# EAGLE design riffle-1.01-FTDI-A (EAGLE 7.2.0)
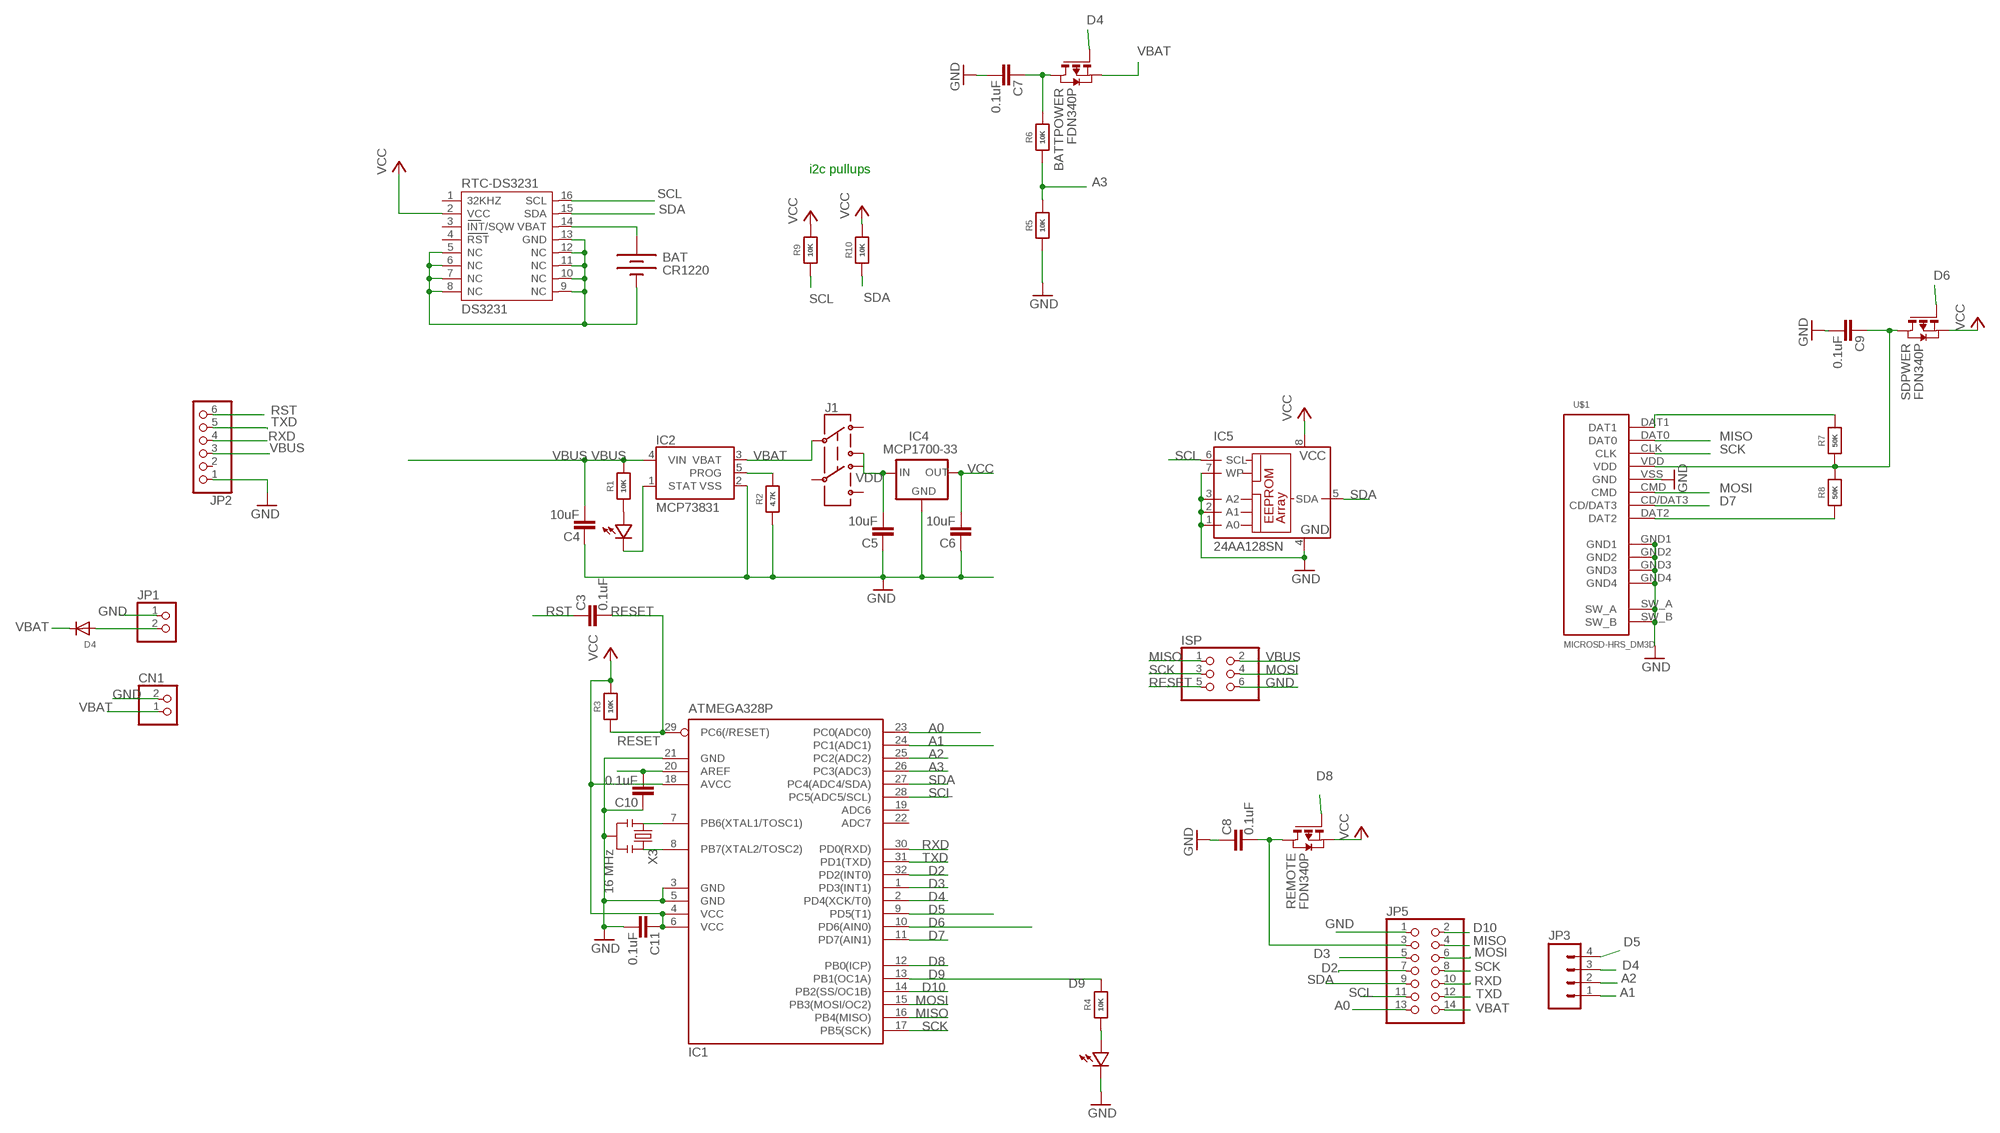
[diagram p0: schematic, sheet 1]

## Parts
BAT  CR1220  BATTERYBATTERY_12MM_SMT  [BATTCON_12MM_SMT]
BATTPOWER  FDN340P  PMOSSOT23  [SOT-23]
C3  0.1uF  CAP0603-CAP  [0603-CAP]
C4  10uF  CAP0603-CAP  [0603-CAP]
C5  10uF  CAP0603-CAP  [0603-CAP]
C6  10uF  CAP0603-CAP  [0603-CAP]
C7  0.1uF  CAP0603-CAP  [0603-CAP]
C8  0.1uF  CAP0603-CAP  [0603-CAP]
C9  0.1uF  CAP0603-CAP  [0603-CAP]
C10  0.1uF  CAP0603-CAP  [0603-CAP]
C11  0.1uF  CAP0603-CAP  [0603-CAP]
CN1  JST_2PIN-SMT-RA  [JST-PH-2-SMT-RA]
D1  LED0603  [0603-LED]
D2  LED0603  [0603-LED]
D4  DIODESOD-323F  [SOD-323F]
IC1  ATMEGA328P  MEGA8-AI  [TQFP32-08]
IC2  MCP73831  [SOT23-5]
IC4  MCP1700-33  MCP1700SOT89  [SOT89]
IC5  24AA128SN  [SO-08]
ISP  PINHD-2X3  [2X03]
J1  AYZ0202  [AYZ0202]
JP1  PINHD-1X2  [1X02]
JP2  PINHD-1X6  [1X06]
JP3  M04SMD  [1X04-SMD]
JP5  PINHD-2X7  [2X07]
R1  10K  RESISTOR_0603_NOOUT  [0603-NO]
R2  4.7K  RESISTOR_0603_NOOUT  [0603-NO]
R3  10K  RESISTOR_0603_NOOUT  [0603-NO]
R4  10K  RESISTOR_0603_NOOUT  [0603-NO]
R5  10K  RESISTOR_0603_NOOUT  [0603-NO]
R6  10K  RESISTOR_0603_NOOUT  [0603-NO]
R7  50K  RESISTOR_0603_NOOUT  [0603-NO]
R8  50K  RESISTOR_0603_NOOUT  [0603-NO]
R9  10K  RESISTOR_0603_NOOUT  [0603-NO]
R10  10K  RESISTOR_0603_NOOUT  [0603-NO]
REMOTE  FDN340P  PMOSSOT23  [SOT-23]
RTC-DS3231  DS3231  [DS3231]
SDPWER  FDN340P  PMOSSOT23  [SOT-23]
U$1  MICROSD-HRS_DM3D  [DM3D]
X3  16 MHz  RESONATORSMD  [RESONATOR-SMD]

## Nets
A0: IC1.23(PC0(ADC0)) JP5.13
A1: IC1.24(PC1(ADC1)) JP3.1
A2: IC1.25(PC2(ADC2)) JP3.2
A3: IC1.26(PC3(ADC3)) R5.2 R6.1
AREF: C10.1 IC1.20(AREF)
D2: IC1.32(PD2(INT0)) JP5.7
D3: IC1.1(PD3(INT1)) JP5.5
D4: BATTPOWER.3(G) IC1.2(PD4(XCK/T0)) JP3.3
D5: IC1.9(PD5(T1)) JP3.4
D6: IC1.10(PD6(AIN0)) SDPWER.3(G)
D7: IC1.11(PD7(AIN1)) U$1.CD/DAT3
D8: IC1.12(PB0(ICP)) REMOTE.3(G)
D9: IC1.13(PB1(OC1A)) R4.2
D10: IC1.14(PB2(SS/OC1B)) JP5.2
GND: BAT.P$1(-) C4.2 C5.2 C6.2 C7.1 C8.2 C9.1 C10.2 C11.1 CN1.2 D2.MINUS IC1.3(GND) IC1.5(GND) IC1.21(GND) IC2.2(VSS) IC4.1(GND) IC5.1(A0) IC5.2(A1) IC5.3(A2) IC5.4(GND) IC5.7(WP) ISP.6 JP1.1 JP2.1 JP5.1 R2.1 R5.1 RTC-DS3231.5(NC) RTC-DS3231.6(NC) RTC-DS3231.7(NC) RTC-DS3231.8(NC) RTC-DS3231.9(NC) RTC-DS3231.10(NC) RTC-DS3231.11(NC) RTC-DS3231.12(NC) RTC-DS3231.13(GND) U$1.GND1 U$1.GND2 U$1.GND3 U$1.GND4 U$1.SW_A U$1.SW_B U$1.VSS(GND) X3.2
MISO: IC1.16(PB4(MISO)) ISP.1 JP5.4 U$1.DAT0
MOSI: IC1.15(PB3(MOSI/OC2)) ISP.4 JP5.6 U$1.CMD
N$1: D1.PLUS R1.1
N$2: IC1.7(PB6(XTAL1/TOSC1)) X3.1
N$3: IC1.8(PB7(XTAL2/TOSC2)) X3.3
N$4: C9.2 R7.1 R8.2 SDPWER.1(D) U$1.VDD
N$5: D1.MINUS IC2.1(STAT)
N$6: IC2.5(PROG) R2.2
N$7: C8.1 JP5.3 REMOTE.1(D)
N$14: D4.A JP1.2
N$15: BATTPOWER.1(D) C7.2 R6.2
N$16: R7.2 U$1.DAT1
N$17: D2.PLUS R4.1
N$18: R8.1 U$1.DAT2
RESET: C3.1 IC1.29(PC6(/RESET)) ISP.5 R3.1
RST: C3.2 JP2.6
RTC_BATT: BAT.P$2(+) RTC-DS3231.14(VBAT)
RXD: IC1.30(PD0(RXD)) JP2.4 JP5.10
SCK: IC1.17(PB5(SCK)) ISP.3 JP5.8 U$1.CLK
SCL: IC1.28(PC5(ADC5/SCL)) IC5.6(SCL) JP5.11 R9.1 RTC-DS3231.16(SCL)
SDA: IC1.27(PC4(ADC4/SDA)) IC5.5(SDA) JP5.9 R10.1 RTC-DS3231.15(SDA)
TXD: IC1.31(PD1(TXD)) JP2.5 JP5.12
VBAT [vcc]: BATTPOWER.2(S) CN1.1 D4.C IC2.3(VBAT) J1.2 JP5.14
VBUS [vcc]: C4.1 IC2.4(VIN) ISP.2 JP2.3 R1.2
VCC: C6.1 C11.2 IC1.4(VCC) IC1.6(VCC) IC1.18(AVCC) IC4.3(OUT) IC5.8(VCC) R3.2 R9.2 R10.2 REMOTE.2(S) RTC-DS3231.2(VCC) SDPWER.2(S)
VDD: C5.1 IC4.2(IN) J1.1
Unconnected: IC1.19(ADC6) IC1.22(ADC7) J1.3 J1.4 J1.5 J1.6 JP2.2 RTC-DS3231.1(32KHZ) RTC-DS3231.3(INT/SQW) RTC-DS3231.4(RST)

## Notes on the sheet
- i2c pullups

## Library data of the parts
BAT = SparkFunNew:BATTERY: Battery Holders Various common sizes : AA, AAA, 20mm coin cell and 12mm coin cell.
BATTPOWER REMOTE SDPWER = zetex:PMOSSOT23: MOS FET; OC_FARNELL: unknown; OC_NEWARK: unknown
C3-C11 = SparkFun:CAP: Capacitor Standard 0603 ceramic capacitor, and 0.1" leaded capacitor.
CN1 = adafruit:JST_2PIN: JST 2-Pin Connectors of various flavors SMT-RA (S2B-PH-SM4) 4UConnector #17311 SMT (B2B-PH-SM4) THM-RA (S2B-PH) THM (B2B-PH)
D1 D2 = LowPowerLab:LED
D4 = adafruit:DIODE: Diode SMADIODE - SMA Surface Mount Package 20V 1A Schottky Diode Digikey: 641-1014-6-ND DO-1N4148 - Through Hole Small Current Diode SOD-123 20V 1 A (.5mV Vf) Schottky Diode - Digikey: MBRX120TPMSCT-ND SOD-323 10V 570mA (.38mV Vf, 3ns) Schottky Diode - Digikey: ZLLS410CT-ND SOD-523 30V 30mA Schottky Diode (RB751S-40TE61) - Digikey: RB751S-40TE61CT-ND SOT23-R/W - SOT23 Package (R = Solder Paste/Reflow Ovens, W = Hand-Soldering) BAT54Film 40V 300mA - Digikey: 497-7162-1-ND
IC1 = atmel:MEGA8: MICROCONTROLLER 8 Kbytes FLASH, 1 kbytes SRAM, 512 bytes EEPROM, USART, 6-channel 10 bit ADC, 2-channel 8 bit ADC Pin compatible with Atmega48, ATMega88, ATMega168 Source: avr.lbr; MPN: ATMEGA8-16AU; OC_FARNELL: 9171371; OC_NEWARK: 73M8863
IC2 = SparkFunNew:MCP73831: Microchip's MCP73831 Miniature single cell, fully integrated Li-Ion, Li-polymer charge management controller http://ww1.microchip.com/downloads/en/DeviceDoc/21984a.pdf
IC4 = adafruit:MCP1700: VOLTAGE REGULATOR
IC5 = microchip:24*: Serial EEPROM I2C; MF: MICROCHIP; MPN: 24AA128-I/SN; OC_FARNELL: unknown; OC_NEWARK: 92C6842
ISP = pinhead:PINHD-2X3: PIN HEADER
J1 = SparkFunNew:AYZ0202: SPDT Slide Switch Simple SMD single-pull double-throw slide switch. Good for less than 350mA power switch, switching UARTs between devices, etc. Spark Fun Electronics SKU : COM-00597
JP1 = pinhead:PINHD-1X2: PIN HEADER
JP2 = pinhead:PINHD-1X6: PIN HEADER
JP3 = SparkFun:M04: Header 4 Standard 4-pin 0.1" header. Use with straight break away headers (SKU : PRT-00116), right angle break away headers (PRT-00553), swiss pins (PRT-00743), machine pins (PRT-00117), and female headers (PRT-00115). Molex polarized connector foot print use with SKU : PRT-08231 with associated crimp pins and housings.
JP5 = pinhead:PINHD-2X7: PIN HEADER
R1-R10 = microbuilder:RESISTOR: Resistors For new designs, use the packages preceded by an '_' character since they are more reliable: The following footprints should be used on most boards: _0402 - Standard footprint for regular board layouts _0603 - Standard footprint for regular board layouts _0805 - Standard footprint for regular board layouts _1206 - Standard footprint for regular board layouts For extremely tight-pitch boards where space is at a premium, the following 'micro-pitch' footprints can be used (smaller pads, no silkscreen outline, etc.): _0402MP - Micro-pitch footprint for very dense/compact boards _0603MP - Micro-pitch footprint for very dense/compact boards _0805MP - Micro-pitch footprint for very dense/compact boards _1206MP - Micro-pitch footprint for very dense/compact boards
RTC-DS3231 = _lh-library:DS3231
U$1 = hrs_DM3D-SF:MICROSD-HRS_DM3D
X3 = SparkFun:RESONATOR: Resonator Small SMD resonator. This is the itty bitty 10/20MHz resonators with built in caps. CSTCE10M0G55 and CSTCE20M0V53. Footprint has been reviewed closely but hasn't been tested yet.

## Board
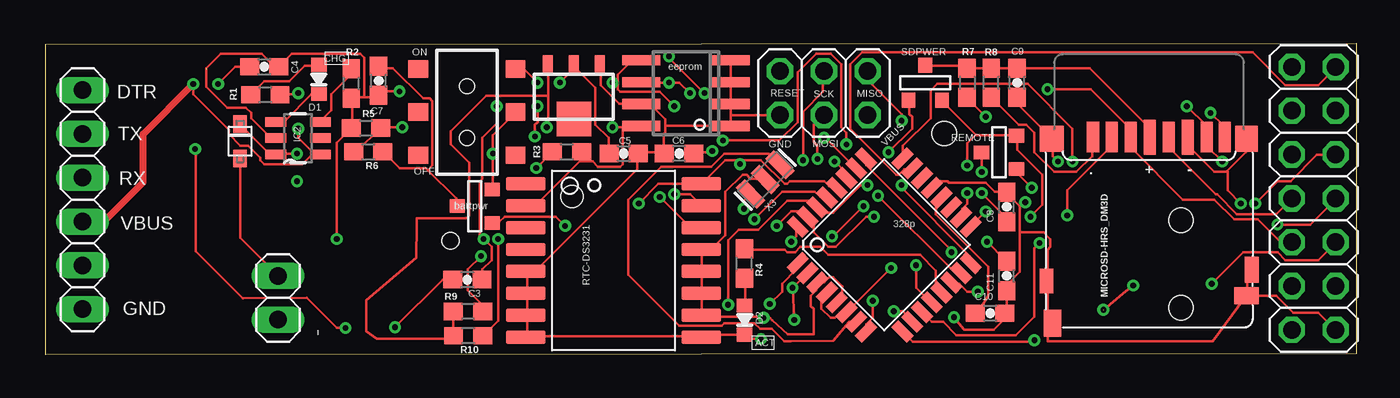
[diagram p1: board, top side]
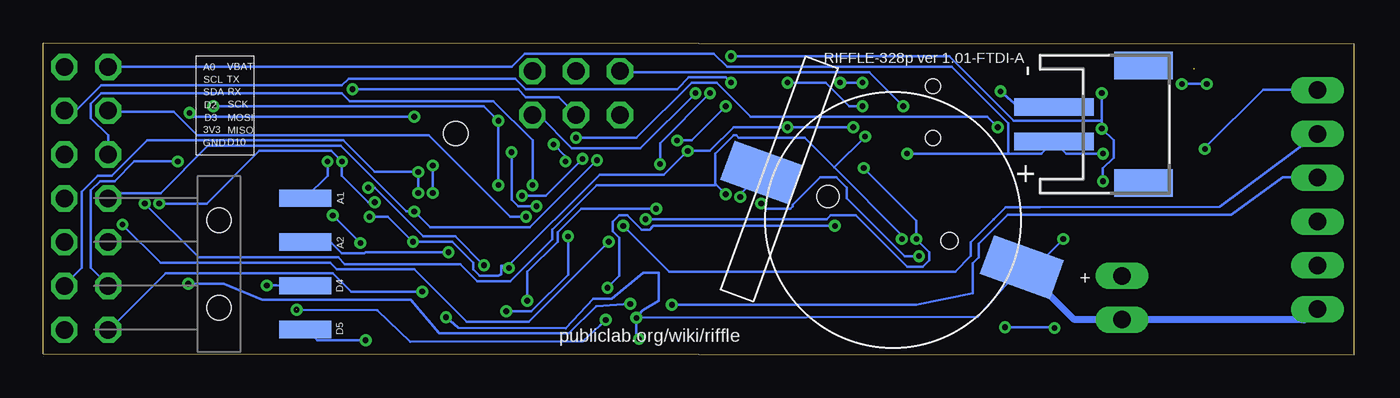
[diagram p2: board, bottom side, seen from below]

Size 76 x 18.06 mm. Coordinates in mm from the lower left corner, seen from the top.
Outline: 0,0 0,18 76,18.06 76,0.06 0,0
Copper layers (1*16): Top 0.0356mm / dielectric 1.5011mm / Bottom 0.0356mm
Design rules "LaenPCBOrder": minimum track width 6mil, minimum drill 13mil, track to track 6mil, track to pad 6mil, pad to pad 6mil, via to via 6mil, smd to smd 6mil, copper to edge 15mil, drill to drill 6mil, minimum pad ring 7mil, minimum via ring 7mil, stop-mask expansion 3mil, vias tented up to drill 0mil, thermal gap 10mil
Holes 1.4 mm at 52.08,12.83

### Footprints (pad centres in the part's own frame; a part is rotated, then mirrored left to right if it is on the bottom)
BATTCON_12MM_SMT = smd 2.4 x 4.3: P$1 0,11.96 | smd 2.4 x 4.2: P$2 0,-4.1 | hole 0.95: 0,7.5 | hole 1.25: 0,0
SOT-23 = smd 0.787 x 0.889: 1 0.025,-1.016; 2 -0.94,1.016; 3 0.991,1.016
0603-CAP = smd 1.1 x 1: 1 -0.85,0; 2 0.85,0
JST-PH-2-SMT-RA = smd 1 x 4.6: 1 1,-3.7; 2 -1,-3.7 | smd 1.6 x 3.4: NC1 -3.4,1.5; NC2 3.4,1.5
0603-LED = smd 0.8 x 0.9: MINUS -0.85,0; PLUS 0.85,0
SOD-323F = smd 1 x 0.8: A -1,0; C 1,0
TQFP32-08 = smd 1.27 x 0.559: 1 -4.293,2.8; 2 -4.293,2; 3 -4.293,1.2; 4 -4.293,0.4; 5 -4.293,-0.4; 6 -4.293,-1.2; 7 -4.293,-2; 8 -4.293,-2.8; 17 4.293,-2.8; 18 4.293,-2; 19 4.293,-1.2; 20 4.293,-0.4; 21 4.293,0.4; 22 4.293,1.2; 23 4.293,2; 24 4.293,2.8 | smd 0.559 x 1.27: 9 -2.8,-4.293; 10 -2,-4.293; 11 -1.2,-4.293; 12 -0.4,-4.293; 13 0.4,-4.293; 14 1.2,-4.293; 15 2,-4.293; 16 2.8,-4.293; 25 2.8,4.293; 26 2,4.293; 27 1.2,4.293; 28 0.4,4.293; 29 -0.4,4.293; 30 -1.2,4.293; 31 -2,4.293; 32 -2.8,4.293
SOT23-5 = smd 0.55 x 1.2: 1 -0.95,-1.3; 2 0,-1.3; 3 0.95,-1.3; 4 0.95,1.3; 5 -0.95,1.3; 6 0,1.3
SOT89 = smd 0.58 x 1.2: 1 -1.5,-1.8; 2 0,-1.8; 3 1.5,-1.8 | smd 2 x 2: 4 0,1.3
SO-08 = smd 0.6 x 2.2: 1 -1.905,-2.6; 2 -0.635,-2.6; 3 0.635,-2.6; 4 1.905,-2.6; 5 1.905,2.6; 6 0.635,2.6; 7 -0.635,2.6; 8 -1.905,2.6
2X03 = drill 1.016 octagon: 1 -2.54,-1.27; 2 -2.54,1.27; 3 0,-1.27; 4 0,1.27; 5 2.54,-1.27; 6 2.54,1.27
AYZ0202 = smd 1 x 1.15: 1 -2.5,2.825; 2 0,2.825; 3 2.5,2.825; 4 -2.5,-2.825; 5 0,-2.825; 6 2.5,-2.825 | hole 0.85: 1.5,0; -1.5,0
1X02 = drill 1.016 long: 1 -1.27,0; 2 1.27,0
1X06 = drill 1.016 long: 1 -6.35,0; 2 -3.81,0; 3 -1.27,0; 4 1.27,0; 5 3.81,0; 6 6.35,0
1X04-SMD = smd 1 x 3: 1 -3.81,5; 2 -1.27,5; 3 1.27,5; 4 3.81,5 | hole 1.4: -2.54,0; 2.54,0
2X07 = drill 1.016 octagon: 1 -7.62,-1.27; 2 -7.62,1.27; 3 -5.08,-1.27; 4 -5.08,1.27; 5 -2.54,-1.27; 6 -2.54,1.27; 7 0,-1.27; 8 0,1.27; 9 2.54,-1.27; 10 2.54,1.27; 11 5.08,-1.27; 12 5.08,1.27; 13 7.62,-1.27; 14 7.62,1.27
0603-NO = smd 1.1 x 1: 1 -0.85,0; 2 0.85,0
DS3231 = smd 0.762 x 2.286: 1 -4.445,-5.08; 2 -3.175,-5.08; 3 -1.905,-5.08; 4 -0.635,-5.08; 5 0.635,-5.08; 6 1.905,-5.08; 7 3.175,-5.08; 8 4.445,-5.08; 9 4.445,5.08; 10 3.175,5.08; 11 1.905,5.08; 12 0.635,5.08; 13 -0.635,5.08; 14 -1.905,5.08; 15 -3.175,5.08; 16 -4.445,5.08
DM3D = smd 0.7 x 1.75: CD/DAT3 8.15,0.45; CLK 4.85,0.45; CMD 7.05,0.45; DAT0 2.65,0.45; DAT1 1.6,0.45; DAT2 9.25,0.45 | smd 0.8 x 1.5: GND1 0.05,8.15 | smd 0.8 x 1.4: GND2 11.95,8.8 | smd 1.4 x 1.5: GND3 11.65,0.55 | smd 1.3 x 1.5: GND4 0.35,0.55 | smd 1 x 1.55: SW_A 11.6,11.25 | smd 1.4 x 1: SW_B 0.35,9.65 | smd 0.7 x 2.032: VDD 5.95,0.45; VSS 3.75,0.45
RESONATOR-SMD = smd 0.7 x 1.7: 1 -1.2,0; 2 0,0; 3 1.2,0

### Placement (x,y rotation side)
BAT  30.5,9.16 250 bottom
BATTPOWER  24.86,8.64 270 top
C3  24.43,4.36 180 top
C4  12.66,16.69 0 top
C5  33.5,11.66 0 top
C6  36.7,11.66 180 top
C7  19.28,15.88 90 top
C8  55.7,8.56 90 top
C9  56.3,15.76 90 top
C10  54.74,2.41 0 top
C11  55.7,4.56 90 top
CN1  13.7,13.36 270 bottom
D1  15.82,15.96 90 top
D2  40.5,2 90 top
D4  11.25,12.37 90 top
IC1  48.6,6.36 45 top
IC2  14.62,12.55 270 top
IC4  30.6,14.96 180 top
IC5  37.1,15.16 90 top
ISP  45.1,15.16 180 top
J1  24.4,14.06 270 top
JP1  13.46,3.3 90 top
JP2  2.12,8.99 90 top
JP3  65.8,5.26 270 bottom
JP5  73.5,9.06 90 top
R1  12.72,15.07 0 top
R2  17.7,15.73 90 top
R3  30.2,11.76 0 top
R4  40.49,5.28 90 top
R5  18.55,13.14 0 top
R6  18.69,11.76 0 top
R7  53.4,15.76 270 top
R8  54.8,15.76 90 top
R9  24.46,2.51 180 top
R10  24.48,1.1 180 top
REMOTE  55.25,11.75 270 top
RTC-DS3231  32.9,5.46 270 top
SDPWER  51,15.76 180 top
U$1  69.95,13.07 180 top
X3  41.7,10.16 225 top

### Tracks (layer width: path | path; a pad name or v marks a point on that pad's centre or on a via)
A0
  Top 0.152: IC1.23 50.22,10.74 49.76,10.74 49.45,10.44 49.3,10.44 46.63,13.11 46.63,16.84 47.32,17.53 69.95,17.53 71.86,15.62 73.76,15.62 74.75,16.61 JP5.13
A1  (via drill 0.33)
  Top 0.152: v59.51,11.2 59.51,13.11 56.92,15.7 51.66,15.7 51.28,15.32 51.28,13.72 49.68,12.12 49.68,11.43 IC1.24
  Bottom 0.152: v59.51,11.2 59.51,10.36 60.73,9.14 JP3.1
A2  (via drill 0.33)
  Top 0.152: v52.5,5.94 52.5,6.02 47.55,10.97 47.55,11.35 IC1.25
  Bottom 0.152: v52.5,5.94 57.3,5.94 57.38,5.87 58.67,5.87 59.28,6.48 60.73,6.48 JP3.2
A3  (via drill 0.33)
  Top 0.152: R6.1 17.91,11.81 18.06,11.81 19.35,13.11 R5.2 19.43,13.18 v20.65,13.18 | v45.11,12.57 45.19,12.57 46.94,10.82 IC1.26
  Bottom 0.152: v45.11,12.57 41.61,12.57 38.4,15.77 36.96,15.77 34.98,13.79 21.26,13.79 v20.65,13.18
AREF
  Top 0.152: C10.1 53.9,2.25 53.91,2.26 54.64,3.43 54.64,5.11 51.59,8.15 51.59,8.76 51.89,9.07 IC1.20
D2  (via drill 0.33)
  Top 0.152: v43.21,6.55 43.51,6.86 43.51,7.39 IC1.32 | v71.4,7.54 73.3,7.54 74.75,8.99 JP5.7
  Bottom 0.152: v43.21,6.55 47.85,1.9 51.43,1.9 54.48,4.95 58.98,4.95 59.36,5.33 69.19,5.33 v71.4,7.54
D3  (via drill 0.33)
  Top 0.152: v41.96,2.95 42.67,3.66 42.67,4.11 43.51,4.95 43.51,5.26 IC1.1 | v67.59,4.11 69.42,5.94 71.4,5.94 71.86,5.49 73.76,5.49 74.75,6.48 JP5.5
  Bottom 0.152: v41.96,2.95 43.93,2.81 45.53,1.23 53.04,1.23 54.69,3.19 63.28,3.19 65.53,4.11 v67.59,4.11
D4  (via drill 0.33)  (1 unrouted)
  Top 0.152: v30.1,7.47 29.57,8 26.59,8 26.29,7.7 25.91,7.7 BATTPOWER.3 | IC1.2 44.12,4.72 v43.28,3.89 v43.38,2.02 | v63.03,4.01 62.43,3.54 61.32,2.62
  Bottom 0.152: v30.1,7.47 40.61,7.47 40.84,7.24 41.3,7.24 42.14,8.08 42.6,8.08 42.98,7.7 42.98,7.16 42.6,6.78 42.6,4.57 v43.28,3.89 | JP3.3 61.58,4.01 62.5,4.01 v63.03,4.01 | v61.3,2.6 56.64,2.59 54.72,0.75 44.7,0.77 43.7,1.7 v43.38,2.02
D5  (via drill 0.33)
  Top 0.152: v57.3,0.84 57.01,0.76 50.24,0.76 49.68,1.3 IC1.9
  Bottom 0.152: v57.3,0.84 60.12,0.84 60.73,1.45 JP3.4
D6  (via drill 0.33)
  Top 0.152: v48.84,11.73 50.22,13.11 50.22,13.79 50.06,13.94 50.06,14.71 SDPWER.3 | v47.4,8.61 45.64,6.86 v45.57,6.86 | v49.15,2.51 49.68,2.51 50.22,1.98 IC1.10
  Bottom 0.152: v48.84,11.73 48.84,8.99 48.46,8.61 v47.4,8.61 | v45.57,6.86 45.57,4.65 47.7,2.51 v49.15,2.51
D7  (via drill 0.33)
  Top 0.152: v57.61,6.48 57.3,6.17 57.3,2.21 56.24,1.13 52.78,1.13 52.01,1.9 51.36,1.9 50.83,2.44 IC1.11 | v59.21,8.08 59.21,9.52 61.8,12.12 61.8,12.57 U$1.CD/DAT3
  Bottom 0.152: v59.21,8.08 v57.61,6.48
D8  (via drill 0.33)
  Top 0.152: v57.15,9.68 56.31,10.52 56.31,10.74 REMOTE.3 | v50.44,5.18 50.44,3.89 51.28,3.05 IC1.12
  Bottom 0.152: v57.15,9.68 56.77,9.68 53.95,6.86 52.12,6.86 v50.44,5.18
D9
  Top 0.152: R4.2 40.54,6.1 42.82,6.1 42.98,5.94 43.43,5.94 43.74,6.25 44.88,6.25 45.34,5.79 50.67,5.79 51.59,4.88 51.59,3.96 51.89,3.66 IC1.13
D10  (via drill 0.33)
  Top 0.152: v54.03,3.66 53.42,3.66 52.96,4.11 52.5,4.11 IC1.14
  Bottom 0.152: v54.03,3.66 58.14,3.66 59.21,4.72 68.88,4.72 72.16,1.45 JP5.2
GND  (via drill 0.33)  (1 unrouted)
  Top 0.152: U$1.SW_B 69.65,3.43 69.65,4.65 69.88,4.88 U$1.GND1 | U$1.SW_B 69.72,3.43 71.32,3.43 72.31,2.44 73.76,2.44 74.75,1.45 JP5.1 | 68.47,10.63 68.43,10.59 67.74,10.59 66.22,12.12 66.22,12.57 U$1.VSS | 68.47,10.63 69.57,11.73 69.57,12.5 U$1.GND4 | C9.1 56.31,14.86 56.31,14.55 58.29,12.57 U$1.GND3 58.37,12.5 58.37,11.51 v58.67,11.2 | 58.06,2.06 58.06,0.77 | 58.06,2.06 58.06,4.27 U$1.GND2 | 58.06,2.06 58.29,1.83 U$1.SW_A | IC1.21 51.36,9.75 51.66,10.06 52.27,10.06 52.35,9.98 54.48,9.98 55.02,9.45 55.63,9.45 C8.2 55.7,9.37 56.43,8.65 | 56.46,7.09 56.46,8.61 56.43,8.65 | 56.46,7.09 56.46,4.8 55.7,4.04 55.7,3.73 C11.1 55.7,3.66 55.69,2.29 55.59,2.23 C10.2 55.78,2.29 54.94,1.45 53.23,1.45 v52.64,2.17 | 56.46,7.09 57.84,7.09 58.22,6.71 58.22,6.25 58.06,6.1 58.06,4.34 U$1.GND2 | v56.77,8.84 56.62,8.84 56.43,8.65 | v69.27,8.76 68.5,9.52 68.5,10.59 68.47,10.63 | 58.06,0.77 67.65,0.77 69.49,3.31 69.57,3.43 U$1.SW_B | 58.06,0.77 U$1.GND2 | IC4.1 32.16,16.69 32.16,15.62 33.22,14.55 34.44,14.55 IC5.7 34.52,14.48 35.05,14.48 35.89,13.64 35.89,13.26 | 35.89,13.26 35.89,12.88 35.81,12.8 35.81,11.81 C6.2 35.81,11.73 34.37,11.73 C5.2 34.29,11.66 34.29,10.74 28.35,4.8 27.97,4.8 RTC-DS3231.5 27.89,4.8 27.89,3.58 RTC-DS3231.6 27.89,3.5 27.89,2.36 RTC-DS3231.7 27.89,2.29 27.89,1.07 RTC-DS3231.8 27.97,1.07 37.95,1.07 RTC-DS3231.9 38.02,1.07 38.1,1.14 40.46,1.14 D2.MINUS 40.54,1.14 40.77,0.91 v41.45,0.91 | 39.7,13.87 39.7,14.48 IC5.2 39.7,14.55 39.7,15.77 IC5.3 39.7,15.85 39.7,16.99 IC5.4 | 39.7,13.87 IC5.1 | IC5.4 | 39.7,13.87 42.52,13.87 ISP.6 | IC5.1 35.89,13.26 | IC5.1 | X3.2 41.68,10.21 40.84,10.21 40.61,10.44 40.39,10.44 39.4,9.45 39.4,6.93 38.63,6.17 38.02,6.17 RTC-DS3231.13 38.02,6.1 38.02,4.88 RTC-DS3231.12 38.02,4.8 38.02,3.58 RTC-DS3231.11 38.02,3.5 38.02,2.36 RTC-DS3231.10 38.02,2.29 38.1,2.21 41.15,2.21 41.99,2.11
  Top 0.152: IC1.5 45.87,3.05 46.18,3.35 46.18,3.96 45.64,4.5 45.42,4.5 45.11,4.19 44.73,4.19 IC1.3 44.65,4.11 44.65,3.73 44.35,3.43 44.35,2.82 44.5,2.67 44.5,1.19 43.01,1.19 42.1,1.99 41.99,2.11 | v41.61,2.13 41.99,2.11 | 18.44,14.93 17.75,14.93 R2.1 17.75,14.86 17.75,13.18 R5.1 16.85,12.29 v16.85,6.71 | 18.44,14.93 19.58,14.93 C7.1 19.26,15.27 v20.5,15.27 | 9.3,16.61 10.13,17.45 12.5,17.45 13.18,16.76 13.49,16.76 C4.2 13.56,16.76 14.25,17.45 18.21,17.45 18.44,17.22 18.44,14.93 | 9.3,16.54 9.3,15.54 10.52,14.33 11.58,14.33 11.89,14.02 11.89,13.72 13.03,12.57 13.26,12.57 IC2.2
  Bottom 0.152: v56.77,8.84 57.15,8.84 58.67,10.36 v58.67,11.2 59.28,11.81 63.47,11.81 66.52,8.76 v69.27,8.76 | v41.61,2.13 41.61,1.07 v41.45,0.91 | 16.23,14.4 17.37,14.4 | 17.37,14.4 CN1.2 | v41.61,2.13 21.81,2.21 19.28,5.03 BAT.P$1 19.2,5.11 19.13,5.18 18.38,5.18 v16.85,6.71 | v52.64,2.17 51.93,1.55 45.71,1.54 44.09,3.24 43.04,3.25 41.21,4.75 40.31,4.75 40.31,3.14 41.24,2.57 41.26,2.54 v41.61,2.13 | 17.37,14.4 19.51,14.41 v20.5,15.27
  Bottom 0.406: JP2.1 2.29,2.64 2.91,2.02 13.45,2.02 JP1.1 16.22,2.03 BAT.P$1
MISO  (via drill 0.33)
  Top 0.152: v68.2,11.2 67.36,12.04 67.36,12.57 U$1.DAT0 67.28,12.65 67.28,13.26 v66.14,14.4 | v49.61,9.83 49.61,9.68 53.57,5.71 53.57,5.33 IC1.16 | v49.61,13.56 49.61,13.94 47.7,15.85 47.7,16.38 ISP.1
  Bottom 0.152: v68.2,11.2 70.71,11.2 71.86,10.06 72.69,10.06 73.23,9.52 73.23,5.03 72.24,4.04 JP5.4 | v49.61,9.83 v49.61,13.56 50.44,14.4 v66.14,14.4
MOSI  (via drill 0.33)
  Top 0.152: JP5.6 72.16,6.55 71.55,6.55 70.26,7.85 68.88,7.85 67.74,8.99 65.91,8.99 62.94,11.96 62.94,12.57 U$1.CMD 62.86,12.65 62.86,13.11 60.58,15.39 v58.06,15.39 | v48.23,9.22 52.65,4.8 53.04,4.8 IC1.15 | v44.73,11.35 44.73,12.12 44.5,12.34 44.5,13.33 45.03,13.87 ISP.4
  Bottom 0.152: v48.23,9.22 46.86,9.22 v44.73,11.35 | v58.06,15.39 48.46,15.39 48.01,14.93 46.1,14.93 45.11,13.94 ISP.4
N$1
  Top 0.152: D1.PLUS 15.77,16.76 15.01,16.76 14.1,15.85 12.65,15.85 11.89,15.09 R1.1
N$2
  Top 0.152: IC1.7 46.94,1.9 46.56,1.9 45.64,0.8 43.18,0.79 42.8,0.79 42.08,1.51 41.4,1.51 41.07,1.83 39.32,1.83 39.17,1.68 36.73,1.68 33.76,4.65 33.76,8.99 35.66,10.9 38.56,10.9 39.32,11.66 41.91,11.66 42.52,11.05 X3.1
N$3  (via drill 0.33)
  Top 0.152: v47.93,3.12 47.93,2.13 47.55,1.75 47.55,1.37 IC1.8 | v40.46,8.46 40.46,8.92 40.84,9.3 X3.3
  Bottom 0.152: v47.93,3.12 47.93,4.8 46.18,6.55 46.18,7.09 44.81,8.46 v40.46,8.46
N$4
  Top 0.152: SDPWER.1 50.98,16.76 53.26,16.76 53.34,16.69 R7.1 53.42,16.61 54.79,16.61 R8.2 54.86,16.61 56.24,16.61 C9.2 56.31,16.61 60.5,16.61 63.93,13.18 63.93,12.65 U$1.VDD
N$5
  Top 0.152: D1.MINUS 15.77,15.09 15.39,15.09 13.87,13.56 13.33,13.56 IC2.1
N$6
  Top 0.152: R2.2 17.68,16.54 17.68,16.23 16.54,15.09 16.54,14.17 15.93,13.56 IC2.5
N$7  (via drill 0.33)
  Top 0.152: v54.25,10.59 54.25,11.66 REMOTE.1 | v54.25,9.37 55.63,8 55.63,7.77 C8.1
  Bottom 0.152: v54.25,9.37 v54.25,10.59 56.77,10.59 58.6,12.42 69.95,12.42 72.01,10.36 72.85,10.36 73.76,9.45 73.76,5.03 74.75,4.04 JP5.3
N$14
  Top 0.152: 11.2,11.43 D4.A 11.25,6.77 JP1.2
N$15
  Top 0.152: 22.14,10.71 22.02,10.82 20.5,10.82 19.58,11.73 R6.2 | 22.14,10.71 23.77,9.07 23.77,8.69 BATTPOWER.1 | 22.14,10.71 22.4,10.97 22.4,14.71 22.25,14.86 21.87,14.86 20.12,16.61 19.66,16.61 C7.2
N$16  (via drill 0.33)
  Top 0.152: v54.48,13.79 53.42,14.86 R7.2 | v67.51,14.02 68.28,13.26 68.28,12.65 U$1.DAT1
  Bottom 0.152: v54.48,13.79 67.28,13.79 v67.51,14.02
N$17
  Top 0.152: D2.PLUS 40.54,2.9 40.54,4.42 R4.1
N$18
  Top 0.152: R8.1 54.86,14.86 56.39,13.33 56.85,13.33 57.3,12.88 57.3,11.73 58.45,10.59 59.74,10.59 60.66,11.51 60.66,12.57 U$1.DAT2
RESET  (via drill 0.33)
  Top 0.152: v28.42,10.82 29.34,11.73 R3.1 | C3.1 25.3,4.42 25.3,4.95 25.83,5.49 25.83,6.25 v25.37,6.71 25.15,6.93 25.15,10.06 25.3,10.21 25.3,12.57 26.14,13.41 v26.14,14.4 | v41.07,7.85 42.67,9.45 44.58,9.45 44.88,9.14 45.26,9.14 IC1.29
  Bottom 0.152: v28.42,10.82 25.37,7.77 v25.37,6.71 24.61,5.94 24.61,5.49 24.99,5.11 25.91,5.11 28.88,8.08 30.33,8.08 30.56,7.85 v41.07,7.85 | v26.14,14.4 28.12,16.38 42.52,16.38 ISP.5
RST  (via drill 0.33)
  Top 0.152: 23.62,4.42 C3.2 23,4.36 v20.23,1.59 | v17.36,1.55 16.85,1.55 15.11,3.29 11.44,3.26 11.42,3.26 8.69,5.99 8.69,11.89 v8.65,11.93
  Bottom 0.152: v20.23,1.59 17.4,1.59 v17.36,1.55 | 2.18,15.28 JP2.6 2.15,15.37 5.27,15.37 8.65,11.99 v8.65,11.93
RTC_BATT  (via drill 0.33)
  Top 0.152: v35.59,9.14 37.34,7.39 37.95,7.39 RTC-DS3231.14
  Bottom 0.152: v35.59,9.14 35.59,9.3 34.37,10.52 BAT.P$2
RXD  (via drill 0.33)
  Top 0.152: v39.55,2.9 39.55,6.63 40.16,7.24 41.3,7.24 42.98,8.92 44.35,8.92 44.65,8.61 IC1.30 44.73,8.53 45.03,8.23 45.64,8.23 47.24,9.83 v47.62,9.83
  Bottom 0.152: v39.55,2.9 25.37,2.9 22.1,3.56 22.1,5.31 21.77,5.64 21.77,6.43 20.08,8.11 7.12,8.11 4.14,10.29 2.15,10.29 JP2.4 | v47.62,9.83 47.62,12.42 49.91,14.71 58.22,14.71 58.67,15.16 72.62,15.16 73.23,14.55 73.23,13.72 72.24,12.73 72.24,11.66 JP5.10
SCK  (via drill 0.33)
  Top 0.152: v54.48,8.31 53.64,7.47 IC1.17 | U$1.CLK 65.15,12.57 65.15,11.96 67.82,9.3 67.89,9.3 69.04,8.15 71.32,8.15 72.16,8.99 JP5.8 | v43.89,11.28 43.89,14.1 45.03,15.24 45.03,16.38 ISP.3
  Bottom 0.152: JP5.8 72.16,9.07 71.86,9.37 69.19,9.37 66.45,12.12 58.75,12.12 54.94,8.31 v54.48,8.31 53.57,7.39 47.78,7.39 v43.89,11.28
SCL  (via drill 0.33)
  Top 0.152: v25.22,5.71 24.46,4.95 24.46,3.73 25.3,2.9 25.3,2.51 R9.1 | v34.37,8.76 35.51,9.91 37.95,9.91 RTC-DS3231.16 38.02,9.91 39.4,11.28 40.23,11.28 | 40.23,11.28 41.45,11.28 42.82,9.91 42.98,9.91 43.13,10.06 45.11,10.06 45.42,9.75 45.8,9.75 IC1.28 | v37.34,15.16 36.73,15.77 v36.12,15.77 34.52,15.77 IC5.6 | 40.23,11.28 v40.23,11.05
  Bottom 0.152: v25.22,5.71 26.06,5.71 29.41,9.07 29.41,9.68 30.02,10.29 30.94,10.29 32.54,8.69 32.54,8.61 32.69,8.46 34.06,8.46 v34.37,8.76 | v37.34,15.16 40.23,12.27 v40.23,11.05 | v36.12,15.77 36.42,16.08 38.56,16.08 39.24,15.39 48.01,15.39 48.62,16 58.29,16 58.67,15.62 72.62,15.62 74.07,14.17 74.75,14.17 JP5.11
SDA  (via drill 0.33)
  Top 0.152: v45.72,11.2 46.41,10.52 46.41,10.29 IC1.27 | v46.41,12.19 46.41,12.88 46.1,13.18 46.1,16.84 45.49,17.45 44.65,17.45 43.59,16.38 43.59,13.49 42.52,12.42 v39.24,12.42 | v36.42,14.4 35.59,15.24 33.3,15.24 33.15,15.39 33.15,15.77 | 33.15,15.77 33.15,16.23 33.91,16.99 34.44,16.99 IC5.5 | v26.21,6.71 26.21,1.98 25.37,1.14 R10.1 | v36.42,9.3 37.34,9.3 37.95,8.69 RTC-DS3231.15 | v70.1,8.76 71.4,10.06 72.16,10.06 73.69,11.58 74.75,11.58 JP5.9 | v32.84,15.77 33.15,15.77 | v28.5,14.4 28.5,13.49 28.35,13.33 v28.35,12.65
  Bottom 0.152: v45.72,11.2 45.72,11.51 v46.41,12.19 | v39.24,12.42 38.4,12.42 v36.42,14.4 | v26.21,6.71 26.21,6.93 30.14,10.86 | 30.14,10.86 31.85,12.57 35.66,12.57 35.81,12.73 35.97,12.73 37.03,11.66 37.03,9.91 37,9.87 | v36.42,9.3 37,9.87 | v70.1,8.76 66.98,5.64 58.9,5.64 58.52,5.26 51.82,5.26 50.83,4.27 48.92,4.27 46.48,6.71 46.48,7.24 43.89,9.83 37.03,9.83 37,9.87 | v32.84,15.77 30.63,15.77 29.26,14.4 v28.5,14.4 | 30.14,10.86 v28.35,12.65
TXD  (via drill 0.33)
  Top 0.152: v42.37,7.47 43.21,8.31 43.81,8.31 44.12,8 IC1.31 44.2,7.92 44.5,7.62 44.5,7.09 45.34,6.25 45.8,6.25 47.55,8 v48.01,8
  Bottom 0.152: v42.37,7.47 39.7,4.8 23.93,4.8 23.22,4.81 23.13,4.81 22.21,5.73 22.21,6.51 20.88,7.85 20.18,8.53 18.22,8.55 7.77,8.57 JP2.5 2.15,12.78 JP2.5 | v48.01,8 48.92,8 53.64,12.73 67.06,12.73 68.43,14.1 72.16,14.1 JP5.12
VBAT  (via drill 0.33)
  Top 0.152: BATTPOWER.2 25.91,9.6 v25.91,11.66 25.91,12.73 27.2,14.02 J1.2 | D4.C 11.28,13.33 12.95,11.66 13.26,11.66 IC2.3 13.33,11.66 v14.55,11.66
  Bottom 0.152: v14.55,11.66 16.69,11.66 17.37,12.34 CN1.1 17.45,12.34 18.14,11.66 20.04,11.66 | 20.04,11.66 v25.91,11.66 | 20.04,11.66 20.04,13.41 23.32,16.69 36.35,16.69 37.11,17.45 48.08,17.45 48.84,16.69 72.16,16.69 JP5.14
VBUS  (via drill 0.33)
  Top 0.152: v9.98,15.7 10.97,16.69 11.73,16.69 C4.1 | v14.63,15.16 14.55,15.09 13.64,15.09 R1.2 | v14.63,13.11 14.63,12.57 15.54,11.66 15.85,11.66 IC2.4 15.47,11.66 14.86,11.05 12.65,11.05 12.42,11.28 12.42,11.43 11.73,12.12 11.28,12.12 10.59,12.8 10.59,13.03 8.53,15.09 v8.53,15.7 | v38.18,15.16 36.12,17.22 v36.12,17.3
  Top 0.406: JP2.3 3.35,7.72 5.63,9.99 5.63,12.79 v8.53,15.7
  Bottom 0.152: v8.53,15.7 v9.98,15.7 | 14.63,13.56 v14.63,13.11 13.94,12.42 13.94,11.43 14.55,10.82 v14.55,10.06 | 14.63,13.56 v14.63,15.16 | v38.18,15.16 41.38,11.96 45.34,11.96 47.24,13.87 47.62,13.87 ISP.2 | v36.12,17.3 23.47,17.3 19.74,13.56 14.63,13.56
VCC  (via drill 0.33)
  Top 0.152: 53.91,12.76 51.97,14.71 SDPWER.2 | 53.91,12.76 53.95,12.73 56.24,12.73 REMOTE.2 56.31,12.65 56.31,11.89 57.76,10.44 57.76,8.69 v57.07,8 | v53.42,9.37 53.42,8.76 53.11,8.46 53.11,8 IC1.18 | v53.42,10.97 53.42,12.27 53.91,12.76 | 30.98,11.24 28.42,8.69 27.89,8.69 RTC-DS3231.2 | 30.98,11.24 31.01,11.28 31.01,11.73 R3.2 | IC1.4 45.26,3.58 44.96,3.28 44.96,2.67 45.49,2.13 45.72,2.13 46.02,2.44 46.41,2.44 IC1.6 46.48,2.51 v49,5.03 | v38.63,11.81 38.56,11.73 37.57,11.73 C6.1 | 33.45,13.18 34.44,13.18 IC5.8 | 33.45,13.18 v32.84,13.18 | v54.56,6.55 55.63,5.49 C11.2 | 29.11,15.01 29.11,13.26 v29.03,13.18 | 29.11,15.01 29.11,16.69 IC4.3 | 23.57,2.51 23.55,2.51 R9.2 23.62,2.44 23.62,1.14 R10.2 23.44,0.91 19.16,0.91 18.55,1.35 18.58,3.16 21.46,5.61 21.49,7.51 21.49,7.92 24.38,7.92 24.54,8.08 24.54,11.12 23.47,12.19 23.47,12.95 25.53,15.01 29.11,15.01 | 34.52,13.26 IC5.8 | 33.45,13.18 33.45,11.05 33.3,10.9 32,10.9 31.7,11.2 31.01,11.2 30.98,11.24 | 33.45,13.18 IC5.8
  Bottom 0.152: v53.42,10.97 v53.42,9.37 | 49.03,5.14 43.74,10.44 40,10.44 v38.63,11.81 37.34,11.81 35.97,13.18 v32.84,13.18 v29.03,13.18 | 49.03,5.14 49.45,5.14 49.45,4.66 49.61,4.57 50.67,4.57 51.05,4.95 51.05,5.33 52.27,6.55 v54.56,6.55 56.01,8 v57.07,8 | v49,5.03 49,5.11 49.03,5.14
VDD  (via drill 0.33)
  Top 0.152: C5.1 32.61,11.73 32.61,12.57 31.85,13.33 31.85,15.47 30.63,16.69 IC4.2 30.63,16.61 v29.79,15.77 | v28.5,15.77 27.74,16.54 27.28,16.54 J1.1
  Bottom 0.152: v29.79,15.77 v28.5,15.77

### Text on the board
tPlace: CHG | ON | eeprom | DTR | RESET | SCK | MISO | TX | IC2 | GND | MOSI | VBUS | OFF | RX | battpwr | 328p | VBUS | GND | - | ACT
bPlace: RIFFLE-328p ver 1.01-FTDI-A | VBAT | A0 | TX | SCL | RX | SDA | SCK | MOSI | D3 | D2 | MISO | 3V3 | D10 | GND | A1 | A2 | + | D4 | publiclab.org/wiki/riffle | D5